# EAGLE design PCB Terminal (EAGLE 9.6.2)
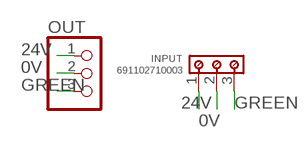
[diagram p0: schematic, sheet 1]

## Parts
INPUT  691102710003  [691102710003]
OUT  PINHD-1X3  [1X03]

## Nets
0V: INPUT.2 OUT.2
24V: INPUT.1 OUT.1
GREEN: INPUT.3 OUT.3

## Library data of the parts
INPUT = 3 pin Terminal Block:691102710003: WR-TBL Serie 102 - 5.00 mm Horiz. Entry Modular KIND PROPERTIES Pitch 5 mm MATERIAL PROPERTIES Insulator Material PA66 Insulator Flammability Rating UL94 V-0 Insulator Color Blue Contact Material Brass Contact Plating Copper over Zinc Terminal Screw Material Steel Terminal Screw Plating Zinc Wire Guard Material Stainless Steel GENERAL INFORMATION Operating Temperature -40 up to +105 °C Compliance Lead free / RoHS ELECTRICAL PROPERTIES IR cULus 15 A IR VDE 17.5 A Working Voltage [cULus] 300 V (AC) Working Voltage [VDE] 250 V (AC) Withstanding Voltage [UL] 1600 V (AC) Withstanding Voltage [cULus] 1600 V (AC) Withstanding Voltage [VDE] 2000 V (AC) Contact Resistance [UL] 20 mΩ Contact Resistance [cULus] 20 mΩ Contact Resistance [VDE] 20 mΩ MECHANICAL PROPERTIES Wire Strip Length 5 up to 6 (mm) Screw M2.6 Solid Wire Section (AWG) 22 to 14 (AWG) Solid Wire Section (Metric) 0.326 to 2.08 (mm) Stranded Wire Section (AWG) 22 to 14 (AWG) Stranded Wire Section (Metric) 0.326 to 2.08 (mm) CERTIFICATION cULus Approval E315414 UL Approval E315414 VDE Approval 40022612 VDE Approval 40022612 Model number 102 PACKAGING PROPERTIES Packaging Box <https://katalog.we-online.com/media/images/v2/o33225v209%20Family_WR-TBL_69110271000x.jpg> Details see: https://katalog.we-online.com/en/em/TBL_5_00_102_6911027100XX Updated by Ella Wu 2019-11-07 2019(C) Wurth Elektronik Check availability <https://pricing.snapeda.com/parts/691102710003/W%C3%BCrth%20Elektronik/view-part?ref=eda>; AVAILABILITY: In Stock; CHECK_PRICES: https://www.snapeda.com/parts/691102710003/Wurth+Elektronik/view-part/?ref=eda; DESCRIPTION: 3 Position Wire to Board Terminal Block Horizontal with Board 0.197 (5.00mm) Through Hole; MF: Würth Elektronik; MP: 691102710003; PACKAGE: None; PRICE: None; PURCHASE-URL: https://www.snapeda.com/api/url_track_click_mouser/?unipart_id=4870208&manufacturer=Würth Elektronik&part_name=691102710003&search_term=terminal block 3 pin; SNAPEDA_LINK: https://www.snapeda.com/parts/691102710003/Wurth+Elektronik/view-part/?ref=snap
OUT = pinhead:PINHD-1X3: PIN HEADER

## Board
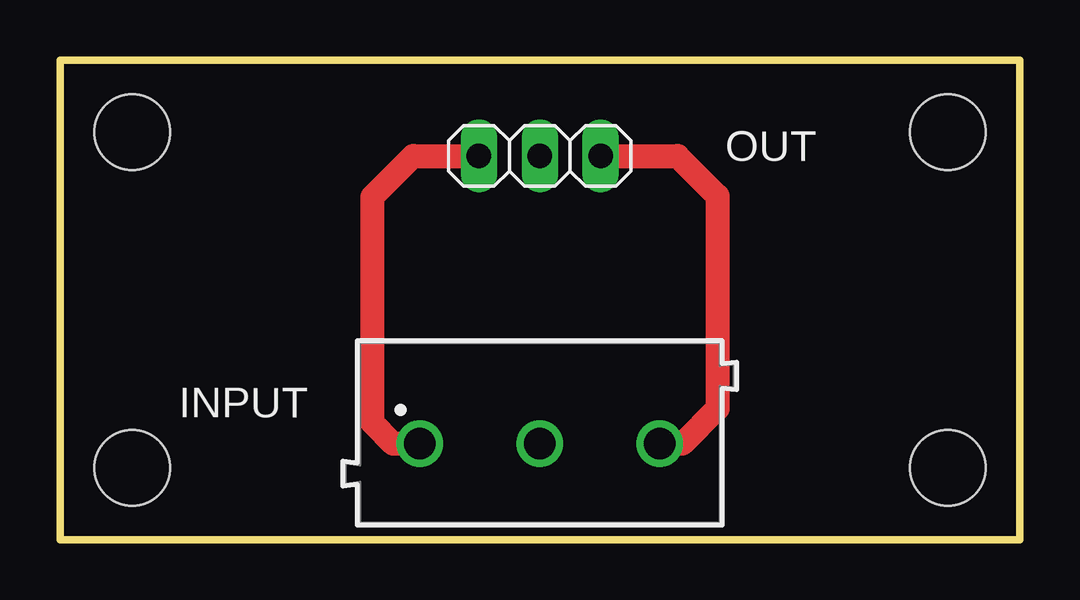
[diagram p1: board, top side]
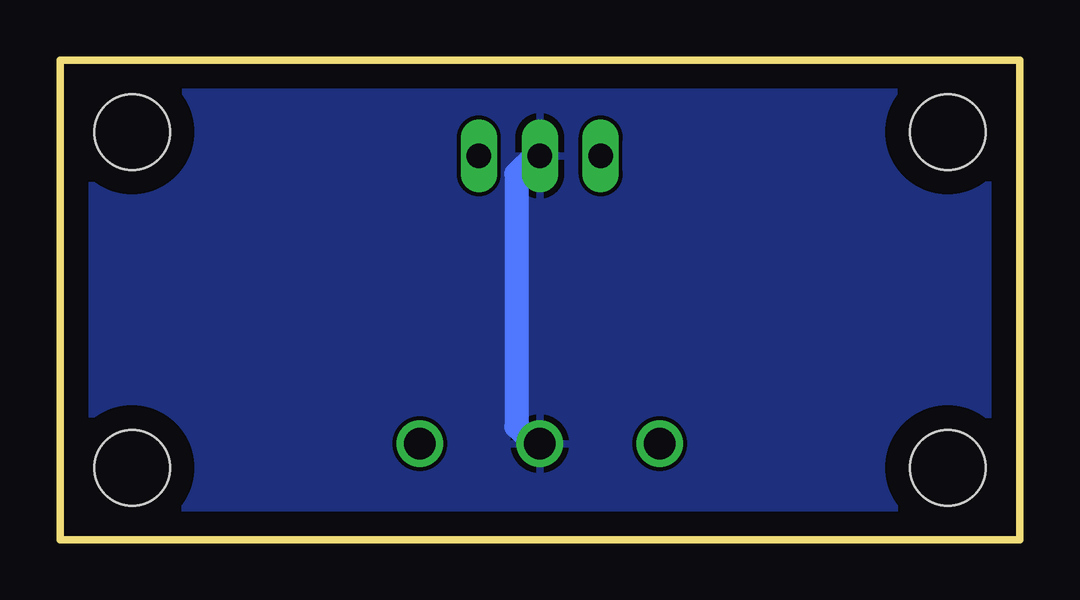
[diagram p2: board, bottom side, seen from below]

Size 40 x 20 mm. Coordinates in mm from the lower left corner, seen from the top.
Outline: 0,0 0,20 40,20 40,0 0,0
Copper layers (1*16): Top 0.035mm / dielectric 1.5mm / Bottom 0.035mm
Design rules "default": minimum track width 6mil, minimum drill 0.35mm, track to track 6mil, track to pad 6mil, pad to pad 6mil, via to via 6mil, smd to smd 6mil, copper to edge 40mil, drill to drill 6mil, minimum pad ring 10mil, minimum via ring 8mil, stop-mask expansion 4mil, vias tented up to drill 0mil, thermal gap 10mil
Holes 3.15 mm at 3,3 37,3 37,17 3,17

### Footprints (pad centres in the part's own frame; a part is rotated, then mirrored left to right if it is on the bottom)
691102710003 = drill 1.3: 1 -5,0; 2 0,0; 3 5,0
1X03 = drill 1.016 long: 1 -2.54,0; 2 0,0; 3 2.54,0

### Placement (x,y rotation side)
INPUT  20,4 0 top
OUT  20,16 0 top

### Tracks (layer width: path | path; a pad name or v marks a point on that pad's centre or on a via)
0V
  Bottom 1: OUT.2 20.23,16 20.97,15.26 20.97,4.72 20.25,4 INPUT.2
  pour Bottom: 0,0 0,20 40,20 40,0
24V
  Top 1: INPUT.1 13.89,4 13.03,4.87 13.03,14.3 14.73,16 OUT.1
GREEN
  Top 1: OUT.3 25.74,16 27.41,14.33 27.41,5.46 25.95,4 INPUT.3